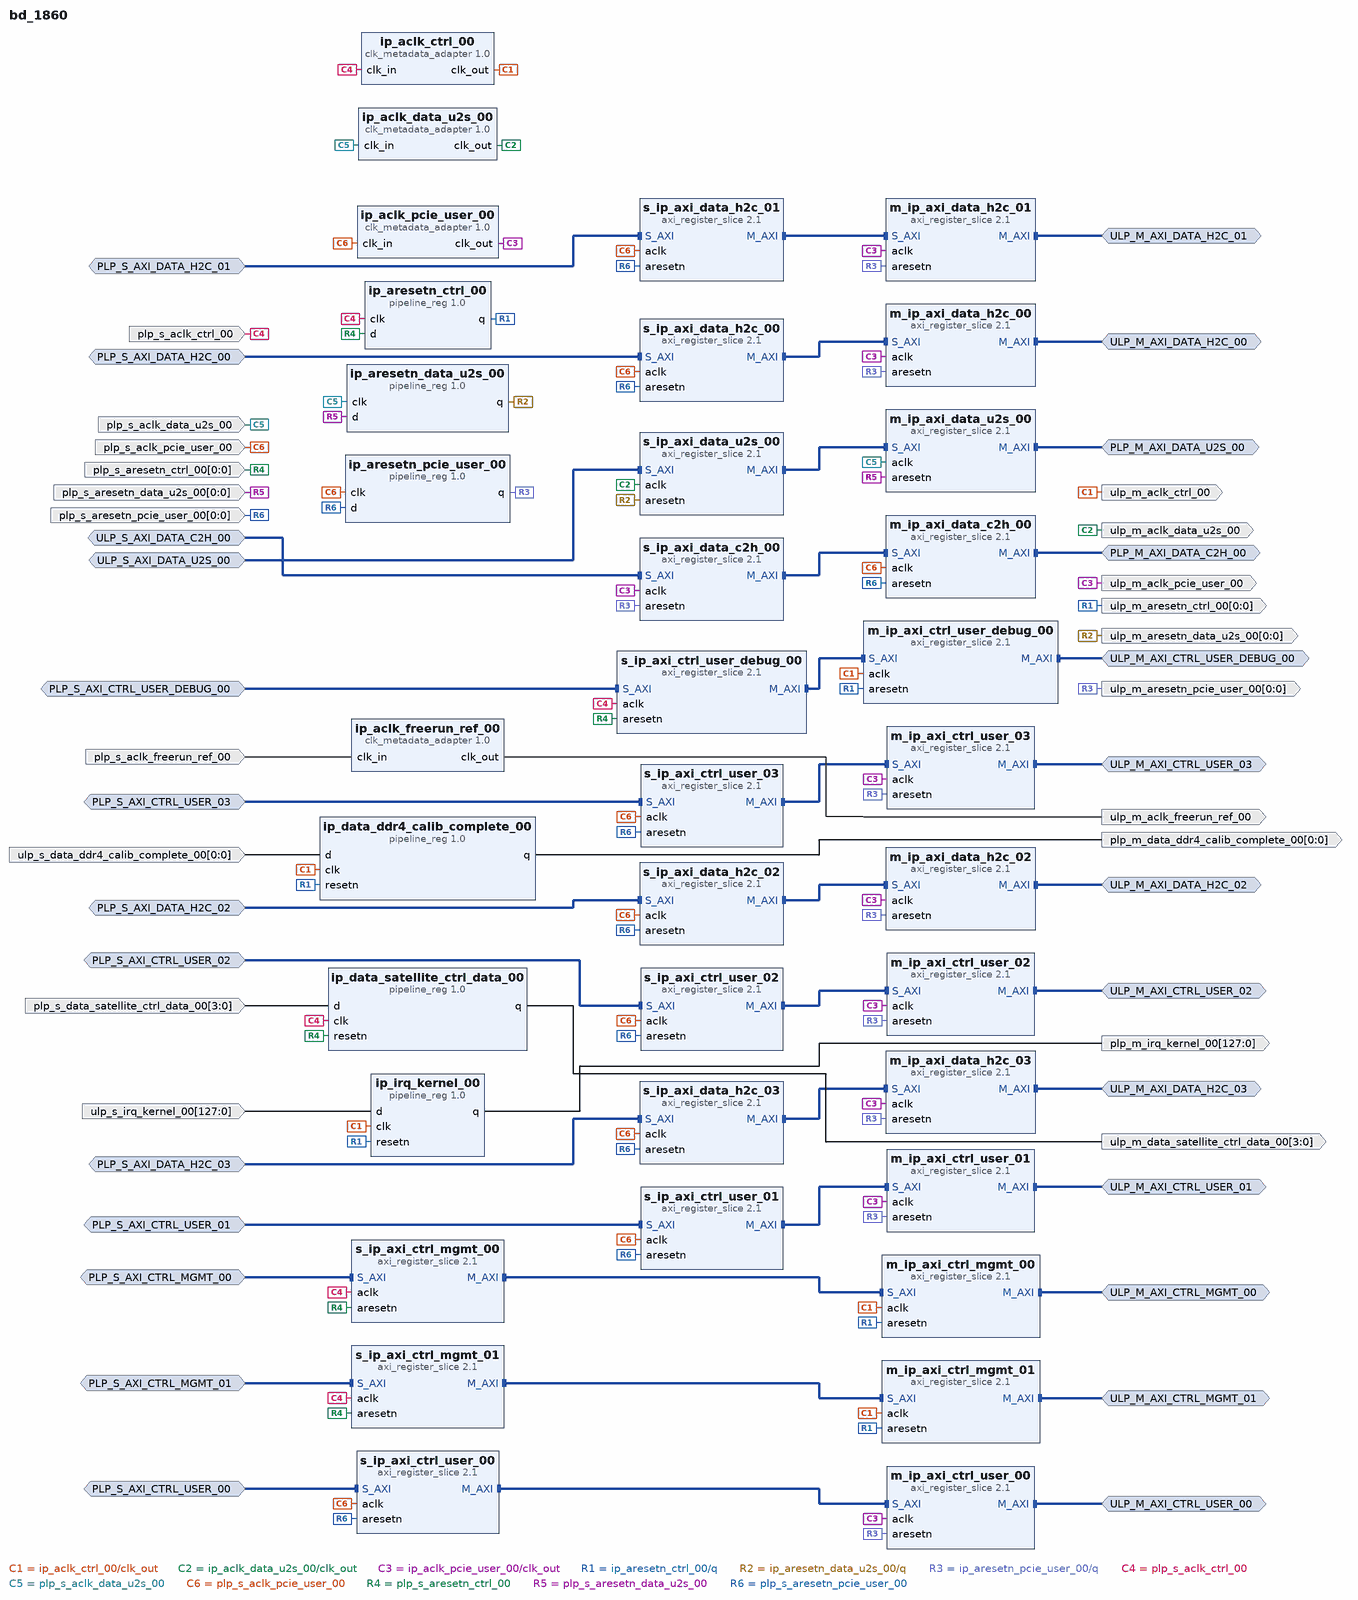
[diagram p0: block diagram of the top level]
# Vivado block design bd_1860, xcu250-figd2104-2L-e, Vivado 2022.2
create_bd_design bd_1860

create_bd_intf_port -mode Slave -vlnv xilinx.com:interface:aximm_rtl:1.0 PLP_S_AXI_CTRL_MGMT_00
set_property -dict [list \
  CONFIG.ADDR_WIDTH 24 \
  CONFIG.ARUSER_WIDTH 0 \
  CONFIG.AWUSER_WIDTH 0 \
  CONFIG.BUSER_WIDTH 0 \
  CONFIG.CLK_DOMAIN cd_ctrl_00 \
  CONFIG.DATA_WIDTH 32 \
  CONFIG.FREQ_HZ 50000000 \
  CONFIG.NUM_READ_OUTSTANDING 2 \
  CONFIG.NUM_WRITE_OUTSTANDING 2 \
  CONFIG.PHASE 0 \
  CONFIG.PROTOCOL AXI4LITE \
  CONFIG.READ_WRITE_MODE READ_WRITE \
  CONFIG.RUSER_WIDTH 0 \
  CONFIG.SLR_ASSIGNMENT slr0 \
  CONFIG.WUSER_WIDTH 0 \
] [get_bd_intf_ports PLP_S_AXI_CTRL_MGMT_00]
create_bd_intf_port -mode Master -vlnv xilinx.com:interface:aximm_rtl:1.0 ULP_M_AXI_CTRL_MGMT_00
set_property -dict [list \
  CONFIG.ADDR_WIDTH 24 \
  CONFIG.ARUSER_WIDTH 0 \
  CONFIG.AWUSER_WIDTH 0 \
  CONFIG.BUSER_WIDTH 0 \
  CONFIG.CLK_DOMAIN cd_ctrl_00 \
  CONFIG.DATA_WIDTH 32 \
  CONFIG.FREQ_HZ 50000000 \
  CONFIG.NUM_READ_OUTSTANDING 2 \
  CONFIG.NUM_WRITE_OUTSTANDING 2 \
  CONFIG.PHASE 0 \
  CONFIG.PROTOCOL AXI4LITE \
  CONFIG.READ_WRITE_MODE READ_WRITE \
  CONFIG.RUSER_WIDTH 0 \
  CONFIG.SLR_ASSIGNMENT slr0 \
  CONFIG.WUSER_WIDTH 0 \
] [get_bd_intf_ports ULP_M_AXI_CTRL_MGMT_00]
create_bd_intf_port -mode Slave -vlnv xilinx.com:interface:aximm_rtl:1.0 PLP_S_AXI_CTRL_MGMT_01
set_property -dict [list \
  CONFIG.ADDR_WIDTH 24 \
  CONFIG.ARUSER_WIDTH 0 \
  CONFIG.AWUSER_WIDTH 0 \
  CONFIG.BUSER_WIDTH 0 \
  CONFIG.CLK_DOMAIN cd_ctrl_00 \
  CONFIG.DATA_WIDTH 32 \
  CONFIG.FREQ_HZ 50000000 \
  CONFIG.NUM_READ_OUTSTANDING 2 \
  CONFIG.NUM_WRITE_OUTSTANDING 2 \
  CONFIG.PHASE 0 \
  CONFIG.PROTOCOL AXI4LITE \
  CONFIG.READ_WRITE_MODE READ_WRITE \
  CONFIG.RUSER_WIDTH 0 \
  CONFIG.SLR_ASSIGNMENT slr2 \
  CONFIG.WUSER_WIDTH 0 \
] [get_bd_intf_ports PLP_S_AXI_CTRL_MGMT_01]
create_bd_intf_port -mode Master -vlnv xilinx.com:interface:aximm_rtl:1.0 ULP_M_AXI_CTRL_MGMT_01
set_property -dict [list \
  CONFIG.ADDR_WIDTH 24 \
  CONFIG.ARUSER_WIDTH 0 \
  CONFIG.AWUSER_WIDTH 0 \
  CONFIG.BUSER_WIDTH 0 \
  CONFIG.CLK_DOMAIN cd_ctrl_00 \
  CONFIG.DATA_WIDTH 32 \
  CONFIG.FREQ_HZ 50000000 \
  CONFIG.NUM_READ_OUTSTANDING 2 \
  CONFIG.NUM_WRITE_OUTSTANDING 2 \
  CONFIG.PHASE 0 \
  CONFIG.PROTOCOL AXI4LITE \
  CONFIG.READ_WRITE_MODE READ_WRITE \
  CONFIG.RUSER_WIDTH 0 \
  CONFIG.SLR_ASSIGNMENT slr2 \
  CONFIG.WUSER_WIDTH 0 \
] [get_bd_intf_ports ULP_M_AXI_CTRL_MGMT_01]
create_bd_intf_port -mode Slave -vlnv xilinx.com:interface:aximm_rtl:1.0 PLP_S_AXI_CTRL_USER_00
set_property -dict [list \
  CONFIG.ADDR_WIDTH 25 \
  CONFIG.ARUSER_WIDTH 0 \
  CONFIG.AWUSER_WIDTH 0 \
  CONFIG.BUSER_WIDTH 0 \
  CONFIG.CLK_DOMAIN cd_pcie_user_00 \
  CONFIG.DATA_WIDTH 32 \
  CONFIG.FREQ_HZ 250000000 \
  CONFIG.NUM_READ_OUTSTANDING 2 \
  CONFIG.NUM_WRITE_OUTSTANDING 2 \
  CONFIG.PHASE 0 \
  CONFIG.PROTOCOL AXI4LITE \
  CONFIG.READ_WRITE_MODE READ_WRITE \
  CONFIG.RUSER_WIDTH 0 \
  CONFIG.SLR_ASSIGNMENT slr0 \
  CONFIG.WUSER_WIDTH 0 \
] [get_bd_intf_ports PLP_S_AXI_CTRL_USER_00]
create_bd_intf_port -mode Master -vlnv xilinx.com:interface:aximm_rtl:1.0 ULP_M_AXI_CTRL_USER_00
set_property -dict [list \
  CONFIG.ADDR_WIDTH 25 \
  CONFIG.ARUSER_WIDTH 0 \
  CONFIG.AWUSER_WIDTH 0 \
  CONFIG.BUSER_WIDTH 0 \
  CONFIG.CLK_DOMAIN cd_pcie_user_00 \
  CONFIG.DATA_WIDTH 32 \
  CONFIG.FREQ_HZ 250000000 \
  CONFIG.NUM_READ_OUTSTANDING 2 \
  CONFIG.NUM_WRITE_OUTSTANDING 2 \
  CONFIG.PHASE 0 \
  CONFIG.PROTOCOL AXI4LITE \
  CONFIG.READ_WRITE_MODE READ_WRITE \
  CONFIG.RUSER_WIDTH 0 \
  CONFIG.SLR_ASSIGNMENT slr0 \
  CONFIG.WUSER_WIDTH 0 \
] [get_bd_intf_ports ULP_M_AXI_CTRL_USER_00]
create_bd_intf_port -mode Slave -vlnv xilinx.com:interface:aximm_rtl:1.0 PLP_S_AXI_CTRL_USER_01
set_property -dict [list \
  CONFIG.ADDR_WIDTH 25 \
  CONFIG.ARUSER_WIDTH 0 \
  CONFIG.AWUSER_WIDTH 0 \
  CONFIG.BUSER_WIDTH 0 \
  CONFIG.CLK_DOMAIN cd_pcie_user_00 \
  CONFIG.DATA_WIDTH 32 \
  CONFIG.FREQ_HZ 250000000 \
  CONFIG.NUM_READ_OUTSTANDING 2 \
  CONFIG.NUM_WRITE_OUTSTANDING 2 \
  CONFIG.PHASE 0 \
  CONFIG.PROTOCOL AXI4LITE \
  CONFIG.READ_WRITE_MODE READ_WRITE \
  CONFIG.RUSER_WIDTH 0 \
  CONFIG.SLR_ASSIGNMENT slr1 \
  CONFIG.WUSER_WIDTH 0 \
] [get_bd_intf_ports PLP_S_AXI_CTRL_USER_01]
create_bd_intf_port -mode Master -vlnv xilinx.com:interface:aximm_rtl:1.0 ULP_M_AXI_CTRL_USER_01
set_property -dict [list \
  CONFIG.ADDR_WIDTH 25 \
  CONFIG.ARUSER_WIDTH 0 \
  CONFIG.AWUSER_WIDTH 0 \
  CONFIG.BUSER_WIDTH 0 \
  CONFIG.CLK_DOMAIN cd_pcie_user_00 \
  CONFIG.DATA_WIDTH 32 \
  CONFIG.FREQ_HZ 250000000 \
  CONFIG.NUM_READ_OUTSTANDING 2 \
  CONFIG.NUM_WRITE_OUTSTANDING 2 \
  CONFIG.PHASE 0 \
  CONFIG.PROTOCOL AXI4LITE \
  CONFIG.READ_WRITE_MODE READ_WRITE \
  CONFIG.RUSER_WIDTH 0 \
  CONFIG.SLR_ASSIGNMENT slr1 \
  CONFIG.WUSER_WIDTH 0 \
] [get_bd_intf_ports ULP_M_AXI_CTRL_USER_01]
create_bd_intf_port -mode Slave -vlnv xilinx.com:interface:aximm_rtl:1.0 PLP_S_AXI_CTRL_USER_02
set_property -dict [list \
  CONFIG.ADDR_WIDTH 25 \
  CONFIG.ARUSER_WIDTH 0 \
  CONFIG.AWUSER_WIDTH 0 \
  CONFIG.BUSER_WIDTH 0 \
  CONFIG.CLK_DOMAIN cd_pcie_user_00 \
  CONFIG.DATA_WIDTH 32 \
  CONFIG.FREQ_HZ 250000000 \
  CONFIG.NUM_READ_OUTSTANDING 2 \
  CONFIG.NUM_WRITE_OUTSTANDING 2 \
  CONFIG.PHASE 0 \
  CONFIG.PROTOCOL AXI4LITE \
  CONFIG.READ_WRITE_MODE READ_WRITE \
  CONFIG.RUSER_WIDTH 0 \
  CONFIG.SLR_ASSIGNMENT slr2 \
  CONFIG.WUSER_WIDTH 0 \
] [get_bd_intf_ports PLP_S_AXI_CTRL_USER_02]
create_bd_intf_port -mode Master -vlnv xilinx.com:interface:aximm_rtl:1.0 ULP_M_AXI_CTRL_USER_02
set_property -dict [list \
  CONFIG.ADDR_WIDTH 25 \
  CONFIG.ARUSER_WIDTH 0 \
  CONFIG.AWUSER_WIDTH 0 \
  CONFIG.BUSER_WIDTH 0 \
  CONFIG.CLK_DOMAIN cd_pcie_user_00 \
  CONFIG.DATA_WIDTH 32 \
  CONFIG.FREQ_HZ 250000000 \
  CONFIG.NUM_READ_OUTSTANDING 2 \
  CONFIG.NUM_WRITE_OUTSTANDING 2 \
  CONFIG.PHASE 0 \
  CONFIG.PROTOCOL AXI4LITE \
  CONFIG.READ_WRITE_MODE READ_WRITE \
  CONFIG.RUSER_WIDTH 0 \
  CONFIG.SLR_ASSIGNMENT slr2 \
  CONFIG.WUSER_WIDTH 0 \
] [get_bd_intf_ports ULP_M_AXI_CTRL_USER_02]
create_bd_intf_port -mode Slave -vlnv xilinx.com:interface:aximm_rtl:1.0 PLP_S_AXI_CTRL_USER_03
set_property -dict [list \
  CONFIG.ADDR_WIDTH 25 \
  CONFIG.ARUSER_WIDTH 0 \
  CONFIG.AWUSER_WIDTH 0 \
  CONFIG.BUSER_WIDTH 0 \
  CONFIG.CLK_DOMAIN cd_pcie_user_00 \
  CONFIG.DATA_WIDTH 32 \
  CONFIG.FREQ_HZ 250000000 \
  CONFIG.NUM_READ_OUTSTANDING 2 \
  CONFIG.NUM_WRITE_OUTSTANDING 2 \
  CONFIG.PHASE 0 \
  CONFIG.PROTOCOL AXI4LITE \
  CONFIG.READ_WRITE_MODE READ_WRITE \
  CONFIG.RUSER_WIDTH 0 \
  CONFIG.SLR_ASSIGNMENT slr2 \
  CONFIG.WUSER_WIDTH 0 \
] [get_bd_intf_ports PLP_S_AXI_CTRL_USER_03]
create_bd_intf_port -mode Master -vlnv xilinx.com:interface:aximm_rtl:1.0 ULP_M_AXI_CTRL_USER_03
set_property -dict [list \
  CONFIG.ADDR_WIDTH 25 \
  CONFIG.ARUSER_WIDTH 0 \
  CONFIG.AWUSER_WIDTH 0 \
  CONFIG.BUSER_WIDTH 0 \
  CONFIG.CLK_DOMAIN cd_pcie_user_00 \
  CONFIG.DATA_WIDTH 32 \
  CONFIG.FREQ_HZ 250000000 \
  CONFIG.NUM_READ_OUTSTANDING 2 \
  CONFIG.NUM_WRITE_OUTSTANDING 2 \
  CONFIG.PHASE 0 \
  CONFIG.PROTOCOL AXI4LITE \
  CONFIG.READ_WRITE_MODE READ_WRITE \
  CONFIG.RUSER_WIDTH 0 \
  CONFIG.SLR_ASSIGNMENT slr2 \
  CONFIG.WUSER_WIDTH 0 \
] [get_bd_intf_ports ULP_M_AXI_CTRL_USER_03]
create_bd_intf_port -mode Slave -vlnv xilinx.com:interface:aximm_rtl:1.0 PLP_S_AXI_CTRL_USER_DEBUG_00
set_property -dict [list \
  CONFIG.ADDR_WIDTH 25 \
  CONFIG.ARUSER_WIDTH 0 \
  CONFIG.AWUSER_WIDTH 0 \
  CONFIG.BUSER_WIDTH 0 \
  CONFIG.CLK_DOMAIN cd_ctrl_00 \
  CONFIG.DATA_WIDTH 32 \
  CONFIG.FREQ_HZ 50000000 \
  CONFIG.HAS_BRESP 1 \
  CONFIG.HAS_BURST 0 \
  CONFIG.HAS_CACHE 0 \
  CONFIG.HAS_LOCK 0 \
  CONFIG.HAS_PROT 1 \
  CONFIG.HAS_QOS 0 \
  CONFIG.HAS_REGION 1 \
  CONFIG.HAS_RRESP 1 \
  CONFIG.HAS_WSTRB 1 \
  CONFIG.ID_WIDTH 0 \
  CONFIG.MAX_BURST_LENGTH 1 \
  CONFIG.NUM_READ_OUTSTANDING 2 \
  CONFIG.NUM_READ_THREADS 1 \
  CONFIG.NUM_WRITE_OUTSTANDING 2 \
  CONFIG.NUM_WRITE_THREADS 1 \
  CONFIG.PHASE 0 \
  CONFIG.PROTOCOL AXI4LITE \
  CONFIG.READ_WRITE_MODE READ_WRITE \
  CONFIG.RUSER_BITS_PER_BYTE 0 \
  CONFIG.RUSER_WIDTH 0 \
  CONFIG.SUPPORTS_NARROW_BURST 0 \
  CONFIG.WUSER_BITS_PER_BYTE 0 \
  CONFIG.WUSER_WIDTH 0 \
] [get_bd_intf_ports PLP_S_AXI_CTRL_USER_DEBUG_00]
create_bd_intf_port -mode Master -vlnv xilinx.com:interface:aximm_rtl:1.0 ULP_M_AXI_CTRL_USER_DEBUG_00
set_property -dict [list \
  CONFIG.ADDR_WIDTH 25 \
  CONFIG.ARUSER_WIDTH 0 \
  CONFIG.AWUSER_WIDTH 0 \
  CONFIG.BUSER_WIDTH 0 \
  CONFIG.CLK_DOMAIN cd_ctrl_00 \
  CONFIG.DATA_WIDTH 32 \
  CONFIG.FREQ_HZ 50000000 \
  CONFIG.HAS_BRESP 1 \
  CONFIG.HAS_BURST 0 \
  CONFIG.HAS_CACHE 0 \
  CONFIG.HAS_LOCK 0 \
  CONFIG.HAS_PROT 1 \
  CONFIG.HAS_QOS 0 \
  CONFIG.HAS_REGION 1 \
  CONFIG.HAS_RRESP 1 \
  CONFIG.HAS_WSTRB 1 \
  CONFIG.ID_WIDTH 0 \
  CONFIG.MAX_BURST_LENGTH 1 \
  CONFIG.NUM_READ_OUTSTANDING 2 \
  CONFIG.NUM_READ_THREADS 1 \
  CONFIG.NUM_WRITE_OUTSTANDING 2 \
  CONFIG.NUM_WRITE_THREADS 1 \
  CONFIG.PHASE 0 \
  CONFIG.PROTOCOL AXI4LITE \
  CONFIG.READ_WRITE_MODE READ_WRITE \
  CONFIG.RUSER_BITS_PER_BYTE 0 \
  CONFIG.RUSER_WIDTH 0 \
  CONFIG.SUPPORTS_NARROW_BURST 0 \
  CONFIG.WUSER_BITS_PER_BYTE 0 \
  CONFIG.WUSER_WIDTH 0 \
] [get_bd_intf_ports ULP_M_AXI_CTRL_USER_DEBUG_00]
create_bd_intf_port -mode Slave -vlnv xilinx.com:interface:aximm_rtl:1.0 ULP_S_AXI_DATA_C2H_00
set_property -dict [list \
  CONFIG.ADDR_WIDTH 39 \
  CONFIG.ARUSER_WIDTH 0 \
  CONFIG.AWUSER_WIDTH 0 \
  CONFIG.BUSER_WIDTH 0 \
  CONFIG.CLK_DOMAIN cd_pcie_user_00 \
  CONFIG.DATA_WIDTH 512 \
  CONFIG.FREQ_HZ 250000000 \
  CONFIG.HAS_BRESP 1 \
  CONFIG.HAS_BURST 1 \
  CONFIG.HAS_CACHE 1 \
  CONFIG.HAS_LOCK 1 \
  CONFIG.HAS_PROT 1 \
  CONFIG.HAS_QOS 0 \
  CONFIG.HAS_REGION 0 \
  CONFIG.HAS_RRESP 1 \
  CONFIG.HAS_WSTRB 1 \
  CONFIG.ID_WIDTH 4 \
  CONFIG.MAX_BURST_LENGTH 256 \
  CONFIG.NUM_READ_OUTSTANDING 64 \
  CONFIG.NUM_READ_THREADS 2 \
  CONFIG.NUM_WRITE_OUTSTANDING 32 \
  CONFIG.NUM_WRITE_THREADS 2 \
  CONFIG.PHASE 0 \
  CONFIG.PROTOCOL AXI4 \
  CONFIG.READ_WRITE_MODE READ_WRITE \
  CONFIG.RUSER_BITS_PER_BYTE 0 \
  CONFIG.RUSER_WIDTH 0 \
  CONFIG.SLR_ASSIGNMENT slr2 \
  CONFIG.SUPPORTS_NARROW_BURST 0 \
  CONFIG.WUSER_BITS_PER_BYTE 0 \
  CONFIG.WUSER_WIDTH 0 \
] [get_bd_intf_ports ULP_S_AXI_DATA_C2H_00]
create_bd_intf_port -mode Master -vlnv xilinx.com:interface:aximm_rtl:1.0 PLP_M_AXI_DATA_C2H_00
set_property -dict [list \
  CONFIG.ADDR_WIDTH 39 \
  CONFIG.ARUSER_WIDTH 0 \
  CONFIG.AWUSER_WIDTH 0 \
  CONFIG.BUSER_WIDTH 0 \
  CONFIG.CLK_DOMAIN cd_pcie_user_00 \
  CONFIG.DATA_WIDTH 512 \
  CONFIG.FREQ_HZ 250000000 \
  CONFIG.HAS_BRESP 1 \
  CONFIG.HAS_BURST 1 \
  CONFIG.HAS_CACHE 1 \
  CONFIG.HAS_LOCK 1 \
  CONFIG.HAS_PROT 1 \
  CONFIG.HAS_QOS 0 \
  CONFIG.HAS_REGION 0 \
  CONFIG.HAS_RRESP 1 \
  CONFIG.HAS_WSTRB 1 \
  CONFIG.ID_WIDTH 4 \
  CONFIG.MAX_BURST_LENGTH 256 \
  CONFIG.NUM_READ_OUTSTANDING 64 \
  CONFIG.NUM_READ_THREADS 2 \
  CONFIG.NUM_WRITE_OUTSTANDING 32 \
  CONFIG.NUM_WRITE_THREADS 2 \
  CONFIG.PHASE 0 \
  CONFIG.PROTOCOL AXI4 \
  CONFIG.READ_WRITE_MODE READ_WRITE \
  CONFIG.RUSER_BITS_PER_BYTE 0 \
  CONFIG.RUSER_WIDTH 0 \
  CONFIG.SLR_ASSIGNMENT slr2 \
  CONFIG.SUPPORTS_NARROW_BURST 0 \
  CONFIG.WUSER_BITS_PER_BYTE 0 \
  CONFIG.WUSER_WIDTH 0 \
] [get_bd_intf_ports PLP_M_AXI_DATA_C2H_00]
create_bd_intf_port -mode Slave -vlnv xilinx.com:interface:aximm_rtl:1.0 PLP_S_AXI_DATA_H2C_00
set_property -dict [list \
  CONFIG.ADDR_WIDTH 39 \
  CONFIG.ARUSER_WIDTH 0 \
  CONFIG.AWUSER_WIDTH 0 \
  CONFIG.BUSER_WIDTH 0 \
  CONFIG.CLK_DOMAIN cd_pcie_user_00 \
  CONFIG.DATA_WIDTH 512 \
  CONFIG.FREQ_HZ 250000000 \
  CONFIG.HAS_BRESP 1 \
  CONFIG.HAS_BURST 1 \
  CONFIG.HAS_CACHE 1 \
  CONFIG.HAS_LOCK 1 \
  CONFIG.HAS_PROT 1 \
  CONFIG.HAS_QOS 0 \
  CONFIG.HAS_REGION 0 \
  CONFIG.HAS_RRESP 1 \
  CONFIG.HAS_WSTRB 1 \
  CONFIG.ID_WIDTH 4 \
  CONFIG.MAX_BURST_LENGTH 256 \
  CONFIG.NUM_READ_OUTSTANDING 16 \
  CONFIG.NUM_READ_THREADS 2 \
  CONFIG.NUM_WRITE_OUTSTANDING 32 \
  CONFIG.NUM_WRITE_THREADS 2 \
  CONFIG.PHASE 0 \
  CONFIG.PROTOCOL AXI4 \
  CONFIG.READ_WRITE_MODE READ_WRITE \
  CONFIG.RUSER_BITS_PER_BYTE 0 \
  CONFIG.RUSER_WIDTH 0 \
  CONFIG.SLR_ASSIGNMENT slr0 \
  CONFIG.SUPPORTS_NARROW_BURST 0 \
  CONFIG.WUSER_BITS_PER_BYTE 0 \
  CONFIG.WUSER_WIDTH 0 \
] [get_bd_intf_ports PLP_S_AXI_DATA_H2C_00]
create_bd_intf_port -mode Master -vlnv xilinx.com:interface:aximm_rtl:1.0 ULP_M_AXI_DATA_H2C_00
set_property -dict [list \
  CONFIG.ADDR_WIDTH 39 \
  CONFIG.ARUSER_WIDTH 0 \
  CONFIG.AWUSER_WIDTH 0 \
  CONFIG.BUSER_WIDTH 0 \
  CONFIG.CLK_DOMAIN cd_pcie_user_00 \
  CONFIG.DATA_WIDTH 512 \
  CONFIG.FREQ_HZ 250000000 \
  CONFIG.HAS_BRESP 1 \
  CONFIG.HAS_BURST 1 \
  CONFIG.HAS_CACHE 1 \
  CONFIG.HAS_LOCK 1 \
  CONFIG.HAS_PROT 1 \
  CONFIG.HAS_QOS 0 \
  CONFIG.HAS_REGION 0 \
  CONFIG.HAS_RRESP 1 \
  CONFIG.HAS_WSTRB 1 \
  CONFIG.ID_WIDTH 4 \
  CONFIG.MAX_BURST_LENGTH 256 \
  CONFIG.NUM_READ_OUTSTANDING 16 \
  CONFIG.NUM_READ_THREADS 2 \
  CONFIG.NUM_WRITE_OUTSTANDING 32 \
  CONFIG.NUM_WRITE_THREADS 2 \
  CONFIG.PHASE 0 \
  CONFIG.PROTOCOL AXI4 \
  CONFIG.READ_WRITE_MODE READ_WRITE \
  CONFIG.RUSER_BITS_PER_BYTE 0 \
  CONFIG.RUSER_WIDTH 0 \
  CONFIG.SLR_ASSIGNMENT slr0 \
  CONFIG.SUPPORTS_NARROW_BURST 0 \
  CONFIG.WUSER_BITS_PER_BYTE 0 \
  CONFIG.WUSER_WIDTH 0 \
] [get_bd_intf_ports ULP_M_AXI_DATA_H2C_00]
create_bd_intf_port -mode Slave -vlnv xilinx.com:interface:aximm_rtl:1.0 PLP_S_AXI_DATA_H2C_01
set_property -dict [list \
  CONFIG.ADDR_WIDTH 39 \
  CONFIG.ARUSER_WIDTH 0 \
  CONFIG.AWUSER_WIDTH 0 \
  CONFIG.BUSER_WIDTH 0 \
  CONFIG.CLK_DOMAIN cd_pcie_user_00 \
  CONFIG.DATA_WIDTH 512 \
  CONFIG.FREQ_HZ 250000000 \
  CONFIG.HAS_BRESP 1 \
  CONFIG.HAS_BURST 1 \
  CONFIG.HAS_CACHE 1 \
  CONFIG.HAS_LOCK 1 \
  CONFIG.HAS_PROT 1 \
  CONFIG.HAS_QOS 0 \
  CONFIG.HAS_REGION 0 \
  CONFIG.HAS_RRESP 1 \
  CONFIG.HAS_WSTRB 1 \
  CONFIG.ID_WIDTH 4 \
  CONFIG.MAX_BURST_LENGTH 256 \
  CONFIG.NUM_READ_OUTSTANDING 16 \
  CONFIG.NUM_READ_THREADS 2 \
  CONFIG.NUM_WRITE_OUTSTANDING 32 \
  CONFIG.NUM_WRITE_THREADS 2 \
  CONFIG.PHASE 0 \
  CONFIG.PROTOCOL AXI4 \
  CONFIG.READ_WRITE_MODE READ_WRITE \
  CONFIG.RUSER_BITS_PER_BYTE 0 \
  CONFIG.RUSER_WIDTH 0 \
  CONFIG.SLR_ASSIGNMENT slr1 \
  CONFIG.SUPPORTS_NARROW_BURST 0 \
  CONFIG.WUSER_BITS_PER_BYTE 0 \
  CONFIG.WUSER_WIDTH 0 \
] [get_bd_intf_ports PLP_S_AXI_DATA_H2C_01]
create_bd_intf_port -mode Master -vlnv xilinx.com:interface:aximm_rtl:1.0 ULP_M_AXI_DATA_H2C_01
set_property -dict [list \
  CONFIG.ADDR_WIDTH 39 \
  CONFIG.ARUSER_WIDTH 0 \
  CONFIG.AWUSER_WIDTH 0 \
  CONFIG.BUSER_WIDTH 0 \
  CONFIG.CLK_DOMAIN cd_pcie_user_00 \
  CONFIG.DATA_WIDTH 512 \
  CONFIG.FREQ_HZ 250000000 \
  CONFIG.HAS_BRESP 1 \
  CONFIG.HAS_BURST 1 \
  CONFIG.HAS_CACHE 1 \
  CONFIG.HAS_LOCK 1 \
  CONFIG.HAS_PROT 1 \
  CONFIG.HAS_QOS 0 \
  CONFIG.HAS_REGION 0 \
  CONFIG.HAS_RRESP 1 \
  CONFIG.HAS_WSTRB 1 \
  CONFIG.ID_WIDTH 4 \
  CONFIG.MAX_BURST_LENGTH 256 \
  CONFIG.NUM_READ_OUTSTANDING 16 \
  CONFIG.NUM_READ_THREADS 2 \
  CONFIG.NUM_WRITE_OUTSTANDING 32 \
  CONFIG.NUM_WRITE_THREADS 2 \
  CONFIG.PHASE 0 \
  CONFIG.PROTOCOL AXI4 \
  CONFIG.READ_WRITE_MODE READ_WRITE \
  CONFIG.RUSER_BITS_PER_BYTE 0 \
  CONFIG.RUSER_WIDTH 0 \
  CONFIG.SLR_ASSIGNMENT slr1 \
  CONFIG.SUPPORTS_NARROW_BURST 0 \
  CONFIG.WUSER_BITS_PER_BYTE 0 \
  CONFIG.WUSER_WIDTH 0 \
] [get_bd_intf_ports ULP_M_AXI_DATA_H2C_01]
create_bd_intf_port -mode Slave -vlnv xilinx.com:interface:aximm_rtl:1.0 PLP_S_AXI_DATA_H2C_02
set_property -dict [list \
  CONFIG.ADDR_WIDTH 39 \
  CONFIG.ARUSER_WIDTH 0 \
  CONFIG.AWUSER_WIDTH 0 \
  CONFIG.BUSER_WIDTH 0 \
  CONFIG.CLK_DOMAIN cd_pcie_user_00 \
  CONFIG.DATA_WIDTH 512 \
  CONFIG.FREQ_HZ 250000000 \
  CONFIG.HAS_BRESP 1 \
  CONFIG.HAS_BURST 1 \
  CONFIG.HAS_CACHE 1 \
  CONFIG.HAS_LOCK 1 \
  CONFIG.HAS_PROT 1 \
  CONFIG.HAS_QOS 0 \
  CONFIG.HAS_REGION 0 \
  CONFIG.HAS_RRESP 1 \
  CONFIG.HAS_WSTRB 1 \
  CONFIG.ID_WIDTH 4 \
  CONFIG.MAX_BURST_LENGTH 256 \
  CONFIG.NUM_READ_OUTSTANDING 16 \
  CONFIG.NUM_READ_THREADS 2 \
  CONFIG.NUM_WRITE_OUTSTANDING 32 \
  CONFIG.NUM_WRITE_THREADS 2 \
  CONFIG.PHASE 0 \
  CONFIG.PROTOCOL AXI4 \
  CONFIG.READ_WRITE_MODE READ_WRITE \
  CONFIG.RUSER_BITS_PER_BYTE 0 \
  CONFIG.RUSER_WIDTH 0 \
  CONFIG.SLR_ASSIGNMENT slr2 \
  CONFIG.SUPPORTS_NARROW_BURST 0 \
  CONFIG.WUSER_BITS_PER_BYTE 0 \
  CONFIG.WUSER_WIDTH 0 \
] [get_bd_intf_ports PLP_S_AXI_DATA_H2C_02]
create_bd_intf_port -mode Master -vlnv xilinx.com:interface:aximm_rtl:1.0 ULP_M_AXI_DATA_H2C_02
set_property -dict [list \
  CONFIG.ADDR_WIDTH 39 \
  CONFIG.ARUSER_WIDTH 0 \
  CONFIG.AWUSER_WIDTH 0 \
  CONFIG.BUSER_WIDTH 0 \
  CONFIG.CLK_DOMAIN cd_pcie_user_00 \
  CONFIG.DATA_WIDTH 512 \
  CONFIG.FREQ_HZ 250000000 \
  CONFIG.HAS_BRESP 1 \
  CONFIG.HAS_BURST 1 \
  CONFIG.HAS_CACHE 1 \
  CONFIG.HAS_LOCK 1 \
  CONFIG.HAS_PROT 1 \
  CONFIG.HAS_QOS 0 \
  CONFIG.HAS_REGION 0 \
  CONFIG.HAS_RRESP 1 \
  CONFIG.HAS_WSTRB 1 \
  CONFIG.ID_WIDTH 4 \
  CONFIG.MAX_BURST_LENGTH 256 \
  CONFIG.NUM_READ_OUTSTANDING 16 \
  CONFIG.NUM_READ_THREADS 2 \
  CONFIG.NUM_WRITE_OUTSTANDING 32 \
  CONFIG.NUM_WRITE_THREADS 2 \
  CONFIG.PHASE 0 \
  CONFIG.PROTOCOL AXI4 \
  CONFIG.READ_WRITE_MODE READ_WRITE \
  CONFIG.RUSER_BITS_PER_BYTE 0 \
  CONFIG.RUSER_WIDTH 0 \
  CONFIG.SLR_ASSIGNMENT slr2 \
  CONFIG.SUPPORTS_NARROW_BURST 0 \
  CONFIG.WUSER_BITS_PER_BYTE 0 \
  CONFIG.WUSER_WIDTH 0 \
] [get_bd_intf_ports ULP_M_AXI_DATA_H2C_02]
create_bd_intf_port -mode Slave -vlnv xilinx.com:interface:aximm_rtl:1.0 PLP_S_AXI_DATA_H2C_03
set_property -dict [list \
  CONFIG.ADDR_WIDTH 39 \
  CONFIG.ARUSER_WIDTH 0 \
  CONFIG.AWUSER_WIDTH 0 \
  CONFIG.BUSER_WIDTH 0 \
  CONFIG.CLK_DOMAIN cd_pcie_user_00 \
  CONFIG.DATA_WIDTH 512 \
  CONFIG.FREQ_HZ 250000000 \
  CONFIG.HAS_BRESP 1 \
  CONFIG.HAS_BURST 1 \
  CONFIG.HAS_CACHE 1 \
  CONFIG.HAS_LOCK 1 \
  CONFIG.HAS_PROT 1 \
  CONFIG.HAS_QOS 0 \
  CONFIG.HAS_REGION 0 \
  CONFIG.HAS_RRESP 1 \
  CONFIG.HAS_WSTRB 1 \
  CONFIG.ID_WIDTH 4 \
  CONFIG.MAX_BURST_LENGTH 256 \
  CONFIG.NUM_READ_OUTSTANDING 16 \
  CONFIG.NUM_READ_THREADS 2 \
  CONFIG.NUM_WRITE_OUTSTANDING 32 \
  CONFIG.NUM_WRITE_THREADS 2 \
  CONFIG.PHASE 0 \
  CONFIG.PROTOCOL AXI4 \
  CONFIG.READ_WRITE_MODE READ_WRITE \
  CONFIG.RUSER_BITS_PER_BYTE 0 \
  CONFIG.RUSER_WIDTH 0 \
  CONFIG.SLR_ASSIGNMENT slr2 \
  CONFIG.SUPPORTS_NARROW_BURST 0 \
  CONFIG.WUSER_BITS_PER_BYTE 0 \
  CONFIG.WUSER_WIDTH 0 \
] [get_bd_intf_ports PLP_S_AXI_DATA_H2C_03]
create_bd_intf_port -mode Master -vlnv xilinx.com:interface:aximm_rtl:1.0 ULP_M_AXI_DATA_H2C_03
set_property -dict [list \
  CONFIG.ADDR_WIDTH 39 \
  CONFIG.ARUSER_WIDTH 0 \
  CONFIG.AWUSER_WIDTH 0 \
  CONFIG.BUSER_WIDTH 0 \
  CONFIG.CLK_DOMAIN cd_pcie_user_00 \
  CONFIG.DATA_WIDTH 512 \
  CONFIG.FREQ_HZ 250000000 \
  CONFIG.HAS_BRESP 1 \
  CONFIG.HAS_BURST 1 \
  CONFIG.HAS_CACHE 1 \
  CONFIG.HAS_LOCK 1 \
  CONFIG.HAS_PROT 1 \
  CONFIG.HAS_QOS 0 \
  CONFIG.HAS_REGION 0 \
  CONFIG.HAS_RRESP 1 \
  CONFIG.HAS_WSTRB 1 \
  CONFIG.ID_WIDTH 4 \
  CONFIG.MAX_BURST_LENGTH 256 \
  CONFIG.NUM_READ_OUTSTANDING 16 \
  CONFIG.NUM_READ_THREADS 2 \
  CONFIG.NUM_WRITE_OUTSTANDING 32 \
  CONFIG.NUM_WRITE_THREADS 2 \
  CONFIG.PHASE 0 \
  CONFIG.PROTOCOL AXI4 \
  CONFIG.READ_WRITE_MODE READ_WRITE \
  CONFIG.RUSER_BITS_PER_BYTE 0 \
  CONFIG.RUSER_WIDTH 0 \
  CONFIG.SLR_ASSIGNMENT slr2 \
  CONFIG.SUPPORTS_NARROW_BURST 0 \
  CONFIG.WUSER_BITS_PER_BYTE 0 \
  CONFIG.WUSER_WIDTH 0 \
] [get_bd_intf_ports ULP_M_AXI_DATA_H2C_03]
create_bd_intf_port -mode Slave -vlnv xilinx.com:interface:aximm_rtl:1.0 ULP_S_AXI_DATA_U2S_00
set_property -dict [list \
  CONFIG.ADDR_WIDTH 39 \
  CONFIG.ARUSER_WIDTH 0 \
  CONFIG.AWUSER_WIDTH 0 \
  CONFIG.BUSER_WIDTH 0 \
  CONFIG.CLK_DOMAIN cd_data_u2s_00 \
  CONFIG.DATA_WIDTH 512 \
  CONFIG.FREQ_HZ 300000000 \
  CONFIG.HAS_BRESP 1 \
  CONFIG.HAS_BURST 1 \
  CONFIG.HAS_CACHE 1 \
  CONFIG.HAS_LOCK 1 \
  CONFIG.HAS_PROT 1 \
  CONFIG.HAS_QOS 0 \
  CONFIG.HAS_REGION 0 \
  CONFIG.HAS_RRESP 1 \
  CONFIG.HAS_WSTRB 1 \
  CONFIG.ID_WIDTH 4 \
  CONFIG.MAX_BURST_LENGTH 256 \
  CONFIG.NUM_READ_OUTSTANDING 16 \
  CONFIG.NUM_READ_THREADS 2 \
  CONFIG.NUM_WRITE_OUTSTANDING 32 \
  CONFIG.NUM_WRITE_THREADS 2 \
  CONFIG.PHASE 0 \
  CONFIG.PROTOCOL AXI4 \
  CONFIG.READ_WRITE_MODE READ_WRITE \
  CONFIG.RUSER_BITS_PER_BYTE 0 \
  CONFIG.RUSER_WIDTH 0 \
  CONFIG.SLR_ASSIGNMENT slr1 \
  CONFIG.SUPPORTS_NARROW_BURST 0 \
  CONFIG.WUSER_BITS_PER_BYTE 0 \
  CONFIG.WUSER_WIDTH 0 \
] [get_bd_intf_ports ULP_S_AXI_DATA_U2S_00]
create_bd_intf_port -mode Master -vlnv xilinx.com:interface:aximm_rtl:1.0 PLP_M_AXI_DATA_U2S_00
set_property -dict [list \
  CONFIG.ADDR_WIDTH 39 \
  CONFIG.ARUSER_WIDTH 0 \
  CONFIG.AWUSER_WIDTH 0 \
  CONFIG.BUSER_WIDTH 0 \
  CONFIG.CLK_DOMAIN cd_data_u2s_00 \
  CONFIG.DATA_WIDTH 512 \
  CONFIG.FREQ_HZ 300000000 \
  CONFIG.HAS_BRESP 1 \
  CONFIG.HAS_BURST 1 \
  CONFIG.HAS_CACHE 1 \
  CONFIG.HAS_LOCK 1 \
  CONFIG.HAS_PROT 1 \
  CONFIG.HAS_QOS 0 \
  CONFIG.HAS_REGION 0 \
  CONFIG.HAS_RRESP 1 \
  CONFIG.HAS_WSTRB 1 \
  CONFIG.ID_WIDTH 4 \
  CONFIG.MAX_BURST_LENGTH 256 \
  CONFIG.NUM_READ_OUTSTANDING 16 \
  CONFIG.NUM_READ_THREADS 2 \
  CONFIG.NUM_WRITE_OUTSTANDING 32 \
  CONFIG.NUM_WRITE_THREADS 2 \
  CONFIG.PHASE 0 \
  CONFIG.PROTOCOL AXI4 \
  CONFIG.READ_WRITE_MODE READ_WRITE \
  CONFIG.RUSER_BITS_PER_BYTE 0 \
  CONFIG.RUSER_WIDTH 0 \
  CONFIG.SLR_ASSIGNMENT slr1 \
  CONFIG.SUPPORTS_NARROW_BURST 0 \
  CONFIG.WUSER_BITS_PER_BYTE 0 \
  CONFIG.WUSER_WIDTH 0 \
] [get_bd_intf_ports PLP_M_AXI_DATA_U2S_00]
create_bd_port -dir I -type clk plp_s_aclk_ctrl_00
set_property -dict [list \
  CONFIG.ASSOCIATED_RESET PLP_S_ARESETN_CTRL_00 \
  CONFIG.CLK_DOMAIN cd_ctrl_00 \
  CONFIG.FREQ_HZ 50000000 \
  CONFIG.PHASE 0 \
] [get_bd_ports plp_s_aclk_ctrl_00]
create_bd_port -dir O -type clk ulp_m_aclk_ctrl_00
set_property -dict [list \
  CONFIG.ASSOCIATED_RESET ULP_M_ARESETN_CTRL_00 \
  CONFIG.CLK_DOMAIN cd_ctrl_00 \
  CONFIG.FREQ_HZ 50000000 \
  CONFIG.PHASE 0 \
] [get_bd_ports ulp_m_aclk_ctrl_00]
create_bd_port -dir I -type clk plp_s_aclk_pcie_user_00
set_property -dict [list \
  CONFIG.ASSOCIATED_RESET PLP_S_ARESETN_PCIE_USER_00 \
  CONFIG.CLK_DOMAIN cd_pcie_user_00 \
  CONFIG.FREQ_HZ 250000000 \
  CONFIG.PHASE 0 \
] [get_bd_ports plp_s_aclk_pcie_user_00]
create_bd_port -dir O -type clk ulp_m_aclk_pcie_user_00
set_property -dict [list \
  CONFIG.ASSOCIATED_RESET ULP_M_ARESETN_PCIE_USER_00 \
  CONFIG.CLK_DOMAIN cd_pcie_user_00 \
  CONFIG.FREQ_HZ 250000000 \
  CONFIG.PHASE 0 \
] [get_bd_ports ulp_m_aclk_pcie_user_00]
create_bd_port -dir I -type clk plp_s_aclk_freerun_ref_00
set_property -dict [list \
  CONFIG.CLK_DOMAIN cd_freerun_ref_00 \
  CONFIG.FREQ_HZ 100000000 \
  CONFIG.PHASE 0 \
] [get_bd_ports plp_s_aclk_freerun_ref_00]
create_bd_port -dir O -type clk ulp_m_aclk_freerun_ref_00
set_property -dict [list \
  CONFIG.CLK_DOMAIN cd_freerun_ref_00 \
  CONFIG.FREQ_HZ 100000000 \
  CONFIG.PHASE 0 \
] [get_bd_ports ulp_m_aclk_freerun_ref_00]
create_bd_port -dir I -type clk plp_s_aclk_data_u2s_00
set_property -dict [list \
  CONFIG.ASSOCIATED_RESET PLP_S_ARESETN_DATA_U2S_00 \
  CONFIG.CLK_DOMAIN cd_data_u2s_00 \
  CONFIG.FREQ_HZ 300000000 \
  CONFIG.PHASE 0 \
] [get_bd_ports plp_s_aclk_data_u2s_00]
create_bd_port -dir O -type clk ulp_m_aclk_data_u2s_00
set_property -dict [list \
  CONFIG.ASSOCIATED_RESET ULP_M_ARESETN_DATA_U2S_00 \
  CONFIG.CLK_DOMAIN cd_data_u2s_00 \
  CONFIG.FREQ_HZ 300000000 \
  CONFIG.PHASE 0 \
] [get_bd_ports ulp_m_aclk_data_u2s_00]
create_bd_port -dir I -from 0 -to 0 -type rst plp_s_aresetn_ctrl_00
set_property -dict {CONFIG.POLARITY ACTIVE_LOW} [get_bd_ports plp_s_aresetn_ctrl_00]
create_bd_port -dir O -from 0 -to 0 -type rst ulp_m_aresetn_ctrl_00
set_property -dict {CONFIG.POLARITY ACTIVE_LOW} [get_bd_ports ulp_m_aresetn_ctrl_00]
create_bd_port -dir I -from 0 -to 0 -type rst plp_s_aresetn_pcie_user_00
set_property -dict {CONFIG.POLARITY ACTIVE_LOW} [get_bd_ports plp_s_aresetn_pcie_user_00]
create_bd_port -dir O -from 0 -to 0 -type rst ulp_m_aresetn_pcie_user_00
set_property -dict {CONFIG.POLARITY ACTIVE_LOW} [get_bd_ports ulp_m_aresetn_pcie_user_00]
create_bd_port -dir I -from 0 -to 0 -type rst plp_s_aresetn_data_u2s_00
set_property -dict {CONFIG.POLARITY ACTIVE_LOW} [get_bd_ports plp_s_aresetn_data_u2s_00]
create_bd_port -dir O -from 0 -to 0 -type rst ulp_m_aresetn_data_u2s_00
set_property -dict {CONFIG.POLARITY ACTIVE_LOW} [get_bd_ports ulp_m_aresetn_data_u2s_00]
create_bd_port -dir I -from 0 -to 0 -type data ulp_s_data_ddr4_calib_complete_00
create_bd_port -dir O -from 0 -to 0 -type data plp_m_data_ddr4_calib_complete_00
create_bd_port -dir I -from 3 -to 0 -type data plp_s_data_satellite_ctrl_data_00
create_bd_port -dir O -from 3 -to 0 -type data ulp_m_data_satellite_ctrl_data_00
create_bd_port -dir I -from 127 -to 0 -type intr ulp_s_irq_kernel_00
set_property -dict {CONFIG.PortWidth 128 CONFIG.SENSITIVITY level_high} [get_bd_ports ulp_s_irq_kernel_00]
create_bd_port -dir O -from 127 -to 0 -type intr plp_m_irq_kernel_00
set_property -dict {CONFIG.SENSITIVITY level_high} [get_bd_ports plp_m_irq_kernel_00]

create_bd_cell -type ip -vlnv xilinx.com:ip:clk_metadata_adapter:1.0 ip_aclk_ctrl_00
create_bd_cell -type ip -vlnv xilinx.com:ip:clk_metadata_adapter:1.0 ip_aclk_pcie_user_00
create_bd_cell -type ip -vlnv xilinx.com:ip:clk_metadata_adapter:1.0 ip_aclk_freerun_ref_00
create_bd_cell -type ip -vlnv xilinx.com:ip:clk_metadata_adapter:1.0 ip_aclk_data_u2s_00
create_bd_cell -type ip -vlnv xilinx.com:ip:pipeline_reg:1.0 ip_aresetn_ctrl_00
set_property -dict {CONFIG.DEPTH 0} [get_bd_cells ip_aresetn_ctrl_00]
create_bd_cell -type ip -vlnv xilinx.com:ip:pipeline_reg:1.0 ip_aresetn_pcie_user_00
set_property -dict {CONFIG.DEPTH 0} [get_bd_cells ip_aresetn_pcie_user_00]
create_bd_cell -type ip -vlnv xilinx.com:ip:pipeline_reg:1.0 ip_aresetn_data_u2s_00
set_property -dict {CONFIG.DEPTH 0} [get_bd_cells ip_aresetn_data_u2s_00]
create_bd_cell -type ip -vlnv xilinx.com:ip:axi_register_slice:2.1 s_ip_axi_ctrl_mgmt_00
set_property -dict [list \
  CONFIG.ADDR_WIDTH 24 \
  CONFIG.DATA_WIDTH 32 \
  CONFIG.NUM_READ_OUTSTANDING 2 \
  CONFIG.NUM_WRITE_OUTSTANDING 2 \
  CONFIG.PROTOCOL AXI4LITE \
  CONFIG.READ_WRITE_MODE READ_WRITE \
  CONFIG.REG_AR 0 \
  CONFIG.REG_AW 0 \
  CONFIG.REG_B 0 \
  CONFIG.REG_R 0 \
  CONFIG.REG_W 0 \
] [get_bd_cells s_ip_axi_ctrl_mgmt_00]
create_bd_cell -type ip -vlnv xilinx.com:ip:axi_register_slice:2.1 m_ip_axi_ctrl_mgmt_00
set_property -dict [list \
  CONFIG.ADDR_WIDTH 24 \
  CONFIG.DATA_WIDTH 32 \
  CONFIG.NUM_READ_OUTSTANDING 2 \
  CONFIG.NUM_WRITE_OUTSTANDING 2 \
  CONFIG.PROTOCOL AXI4LITE \
  CONFIG.READ_WRITE_MODE READ_WRITE \
  CONFIG.REG_AR 0 \
  CONFIG.REG_AW 0 \
  CONFIG.REG_B 0 \
  CONFIG.REG_R 0 \
  CONFIG.REG_W 0 \
] [get_bd_cells m_ip_axi_ctrl_mgmt_00]
create_bd_cell -type ip -vlnv xilinx.com:ip:axi_register_slice:2.1 s_ip_axi_ctrl_mgmt_01
set_property -dict [list \
  CONFIG.ADDR_WIDTH 24 \
  CONFIG.DATA_WIDTH 32 \
  CONFIG.NUM_READ_OUTSTANDING 2 \
  CONFIG.NUM_WRITE_OUTSTANDING 2 \
  CONFIG.PROTOCOL AXI4LITE \
  CONFIG.READ_WRITE_MODE READ_WRITE \
  CONFIG.REG_AR 0 \
  CONFIG.REG_AW 0 \
  CONFIG.REG_B 0 \
  CONFIG.REG_R 0 \
  CONFIG.REG_W 0 \
] [get_bd_cells s_ip_axi_ctrl_mgmt_01]
create_bd_cell -type ip -vlnv xilinx.com:ip:axi_register_slice:2.1 m_ip_axi_ctrl_mgmt_01
set_property -dict [list \
  CONFIG.ADDR_WIDTH 24 \
  CONFIG.DATA_WIDTH 32 \
  CONFIG.NUM_READ_OUTSTANDING 2 \
  CONFIG.NUM_WRITE_OUTSTANDING 2 \
  CONFIG.PROTOCOL AXI4LITE \
  CONFIG.READ_WRITE_MODE READ_WRITE \
  CONFIG.REG_AR 0 \
  CONFIG.REG_AW 0 \
  CONFIG.REG_B 0 \
  CONFIG.REG_R 0 \
  CONFIG.REG_W 0 \
] [get_bd_cells m_ip_axi_ctrl_mgmt_01]
create_bd_cell -type ip -vlnv xilinx.com:ip:axi_register_slice:2.1 s_ip_axi_ctrl_user_00
set_property -dict [list \
  CONFIG.ADDR_WIDTH 25 \
  CONFIG.DATA_WIDTH 32 \
  CONFIG.NUM_READ_OUTSTANDING 2 \
  CONFIG.NUM_WRITE_OUTSTANDING 2 \
  CONFIG.PROTOCOL AXI4LITE \
  CONFIG.READ_WRITE_MODE READ_WRITE \
  CONFIG.REG_AR 0 \
  CONFIG.REG_AW 0 \
  CONFIG.REG_B 0 \
  CONFIG.REG_R 0 \
  CONFIG.REG_W 0 \
] [get_bd_cells s_ip_axi_ctrl_user_00]
create_bd_cell -type ip -vlnv xilinx.com:ip:axi_register_slice:2.1 m_ip_axi_ctrl_user_00
set_property -dict [list \
  CONFIG.ADDR_WIDTH 25 \
  CONFIG.DATA_WIDTH 32 \
  CONFIG.NUM_READ_OUTSTANDING 2 \
  CONFIG.NUM_WRITE_OUTSTANDING 2 \
  CONFIG.PROTOCOL AXI4LITE \
  CONFIG.READ_WRITE_MODE READ_WRITE \
  CONFIG.REG_AR 0 \
  CONFIG.REG_AW 0 \
  CONFIG.REG_B 0 \
  CONFIG.REG_R 0 \
  CONFIG.REG_W 0 \
] [get_bd_cells m_ip_axi_ctrl_user_00]
create_bd_cell -type ip -vlnv xilinx.com:ip:axi_register_slice:2.1 s_ip_axi_ctrl_user_01
set_property -dict [list \
  CONFIG.ADDR_WIDTH 25 \
  CONFIG.DATA_WIDTH 32 \
  CONFIG.NUM_READ_OUTSTANDING 2 \
  CONFIG.NUM_WRITE_OUTSTANDING 2 \
  CONFIG.PROTOCOL AXI4LITE \
  CONFIG.READ_WRITE_MODE READ_WRITE \
  CONFIG.REG_AR 0 \
  CONFIG.REG_AW 0 \
  CONFIG.REG_B 0 \
  CONFIG.REG_R 0 \
  CONFIG.REG_W 0 \
] [get_bd_cells s_ip_axi_ctrl_user_01]
create_bd_cell -type ip -vlnv xilinx.com:ip:axi_register_slice:2.1 m_ip_axi_ctrl_user_01
set_property -dict [list \
  CONFIG.ADDR_WIDTH 25 \
  CONFIG.DATA_WIDTH 32 \
  CONFIG.NUM_READ_OUTSTANDING 2 \
  CONFIG.NUM_WRITE_OUTSTANDING 2 \
  CONFIG.PROTOCOL AXI4LITE \
  CONFIG.READ_WRITE_MODE READ_WRITE \
  CONFIG.REG_AR 0 \
  CONFIG.REG_AW 0 \
  CONFIG.REG_B 0 \
  CONFIG.REG_R 0 \
  CONFIG.REG_W 0 \
] [get_bd_cells m_ip_axi_ctrl_user_01]
create_bd_cell -type ip -vlnv xilinx.com:ip:axi_register_slice:2.1 s_ip_axi_ctrl_user_02
set_property -dict [list \
  CONFIG.ADDR_WIDTH 25 \
  CONFIG.DATA_WIDTH 32 \
  CONFIG.NUM_READ_OUTSTANDING 2 \
  CONFIG.NUM_WRITE_OUTSTANDING 2 \
  CONFIG.PROTOCOL AXI4LITE \
  CONFIG.READ_WRITE_MODE READ_WRITE \
  CONFIG.REG_AR 0 \
  CONFIG.REG_AW 0 \
  CONFIG.REG_B 0 \
  CONFIG.REG_R 0 \
  CONFIG.REG_W 0 \
] [get_bd_cells s_ip_axi_ctrl_user_02]
create_bd_cell -type ip -vlnv xilinx.com:ip:axi_register_slice:2.1 m_ip_axi_ctrl_user_02
set_property -dict [list \
  CONFIG.ADDR_WIDTH 25 \
  CONFIG.DATA_WIDTH 32 \
  CONFIG.NUM_READ_OUTSTANDING 2 \
  CONFIG.NUM_WRITE_OUTSTANDING 2 \
  CONFIG.PROTOCOL AXI4LITE \
  CONFIG.READ_WRITE_MODE READ_WRITE \
  CONFIG.REG_AR 0 \
  CONFIG.REG_AW 0 \
  CONFIG.REG_B 0 \
  CONFIG.REG_R 0 \
  CONFIG.REG_W 0 \
] [get_bd_cells m_ip_axi_ctrl_user_02]
create_bd_cell -type ip -vlnv xilinx.com:ip:axi_register_slice:2.1 s_ip_axi_ctrl_user_03
set_property -dict [list \
  CONFIG.ADDR_WIDTH 25 \
  CONFIG.DATA_WIDTH 32 \
  CONFIG.NUM_READ_OUTSTANDING 2 \
  CONFIG.NUM_WRITE_OUTSTANDING 2 \
  CONFIG.PROTOCOL AXI4LITE \
  CONFIG.READ_WRITE_MODE READ_WRITE \
  CONFIG.REG_AR 0 \
  CONFIG.REG_AW 0 \
  CONFIG.REG_B 0 \
  CONFIG.REG_R 0 \
  CONFIG.REG_W 0 \
] [get_bd_cells s_ip_axi_ctrl_user_03]
create_bd_cell -type ip -vlnv xilinx.com:ip:axi_register_slice:2.1 m_ip_axi_ctrl_user_03
set_property -dict [list \
  CONFIG.ADDR_WIDTH 25 \
  CONFIG.DATA_WIDTH 32 \
  CONFIG.NUM_READ_OUTSTANDING 2 \
  CONFIG.NUM_WRITE_OUTSTANDING 2 \
  CONFIG.PROTOCOL AXI4LITE \
  CONFIG.READ_WRITE_MODE READ_WRITE \
  CONFIG.REG_AR 0 \
  CONFIG.REG_AW 0 \
  CONFIG.REG_B 0 \
  CONFIG.REG_R 0 \
  CONFIG.REG_W 0 \
] [get_bd_cells m_ip_axi_ctrl_user_03]
create_bd_cell -type ip -vlnv xilinx.com:ip:axi_register_slice:2.1 s_ip_axi_ctrl_user_debug_00
set_property -dict [list \
  CONFIG.ADDR_WIDTH 25 \
  CONFIG.DATA_WIDTH 32 \
  CONFIG.HAS_BRESP 1 \
  CONFIG.HAS_BURST 0 \
  CONFIG.HAS_CACHE 0 \
  CONFIG.HAS_LOCK 0 \
  CONFIG.HAS_PROT 1 \
  CONFIG.HAS_QOS 0 \
  CONFIG.HAS_REGION 1 \
  CONFIG.HAS_RRESP 1 \
  CONFIG.HAS_WSTRB 1 \
  CONFIG.MAX_BURST_LENGTH 1 \
  CONFIG.NUM_READ_OUTSTANDING 2 \
  CONFIG.NUM_READ_THREADS 1 \
  CONFIG.NUM_WRITE_OUTSTANDING 2 \
  CONFIG.NUM_WRITE_THREADS 1 \
  CONFIG.PROTOCOL AXI4LITE \
  CONFIG.READ_WRITE_MODE READ_WRITE \
  CONFIG.REG_AR 0 \
  CONFIG.REG_AW 0 \
  CONFIG.REG_B 0 \
  CONFIG.REG_R 0 \
  CONFIG.REG_W 0 \
  CONFIG.RUSER_BITS_PER_BYTE 0 \
  CONFIG.SUPPORTS_NARROW_BURST 0 \
  CONFIG.WUSER_BITS_PER_BYTE 0 \
] [get_bd_cells s_ip_axi_ctrl_user_debug_00]
create_bd_cell -type ip -vlnv xilinx.com:ip:axi_register_slice:2.1 m_ip_axi_ctrl_user_debug_00
set_property -dict [list \
  CONFIG.ADDR_WIDTH 25 \
  CONFIG.DATA_WIDTH 32 \
  CONFIG.HAS_BRESP 1 \
  CONFIG.HAS_BURST 0 \
  CONFIG.HAS_CACHE 0 \
  CONFIG.HAS_LOCK 0 \
  CONFIG.HAS_PROT 1 \
  CONFIG.HAS_QOS 0 \
  CONFIG.HAS_REGION 1 \
  CONFIG.HAS_RRESP 1 \
  CONFIG.HAS_WSTRB 1 \
  CONFIG.MAX_BURST_LENGTH 1 \
  CONFIG.NUM_READ_OUTSTANDING 2 \
  CONFIG.NUM_READ_THREADS 1 \
  CONFIG.NUM_WRITE_OUTSTANDING 2 \
  CONFIG.NUM_WRITE_THREADS 1 \
  CONFIG.PROTOCOL AXI4LITE \
  CONFIG.READ_WRITE_MODE READ_WRITE \
  CONFIG.REG_AR 0 \
  CONFIG.REG_AW 0 \
  CONFIG.REG_B 0 \
  CONFIG.REG_R 0 \
  CONFIG.REG_W 0 \
  CONFIG.RUSER_BITS_PER_BYTE 0 \
  CONFIG.SUPPORTS_NARROW_BURST 0 \
  CONFIG.WUSER_BITS_PER_BYTE 0 \
] [get_bd_cells m_ip_axi_ctrl_user_debug_00]
create_bd_cell -type ip -vlnv xilinx.com:ip:axi_register_slice:2.1 s_ip_axi_data_c2h_00
set_property -dict [list \
  CONFIG.ADDR_WIDTH 39 \
  CONFIG.ARUSER_WIDTH 0 \
  CONFIG.AWUSER_WIDTH 0 \
  CONFIG.BUSER_WIDTH 0 \
  CONFIG.DATA_WIDTH 512 \
  CONFIG.HAS_BRESP 1 \
  CONFIG.HAS_BURST 1 \
  CONFIG.HAS_CACHE 1 \
  CONFIG.HAS_LOCK 1 \
  CONFIG.HAS_PROT 1 \
  CONFIG.HAS_QOS 0 \
  CONFIG.HAS_REGION 0 \
  CONFIG.HAS_RRESP 1 \
  CONFIG.HAS_WSTRB 1 \
  CONFIG.ID_WIDTH 4 \
  CONFIG.MAX_BURST_LENGTH 256 \
  CONFIG.NUM_READ_OUTSTANDING 64 \
  CONFIG.NUM_READ_THREADS 2 \
  CONFIG.NUM_WRITE_OUTSTANDING 32 \
  CONFIG.NUM_WRITE_THREADS 2 \
  CONFIG.PROTOCOL AXI4 \
  CONFIG.READ_WRITE_MODE READ_WRITE \
  CONFIG.REG_AR 0 \
  CONFIG.REG_AW 0 \
  CONFIG.REG_B 0 \
  CONFIG.REG_R 0 \
  CONFIG.REG_W 0 \
  CONFIG.RUSER_BITS_PER_BYTE 0 \
  CONFIG.RUSER_WIDTH 0 \
  CONFIG.SUPPORTS_NARROW_BURST 0 \
  CONFIG.WUSER_BITS_PER_BYTE 0 \
  CONFIG.WUSER_WIDTH 0 \
] [get_bd_cells s_ip_axi_data_c2h_00]
create_bd_cell -type ip -vlnv xilinx.com:ip:axi_register_slice:2.1 m_ip_axi_data_c2h_00
set_property -dict [list \
  CONFIG.ADDR_WIDTH 39 \
  CONFIG.ARUSER_WIDTH 0 \
  CONFIG.AWUSER_WIDTH 0 \
  CONFIG.BUSER_WIDTH 0 \
  CONFIG.DATA_WIDTH 512 \
  CONFIG.HAS_BRESP 1 \
  CONFIG.HAS_BURST 1 \
  CONFIG.HAS_CACHE 1 \
  CONFIG.HAS_LOCK 1 \
  CONFIG.HAS_PROT 1 \
  CONFIG.HAS_QOS 0 \
  CONFIG.HAS_REGION 0 \
  CONFIG.HAS_RRESP 1 \
  CONFIG.HAS_WSTRB 1 \
  CONFIG.ID_WIDTH 4 \
  CONFIG.MAX_BURST_LENGTH 256 \
  CONFIG.NUM_READ_OUTSTANDING 64 \
  CONFIG.NUM_READ_THREADS 2 \
  CONFIG.NUM_WRITE_OUTSTANDING 32 \
  CONFIG.NUM_WRITE_THREADS 2 \
  CONFIG.PROTOCOL AXI4 \
  CONFIG.READ_WRITE_MODE READ_WRITE \
  CONFIG.REG_AR 0 \
  CONFIG.REG_AW 0 \
  CONFIG.REG_B 0 \
  CONFIG.REG_R 0 \
  CONFIG.REG_W 0 \
  CONFIG.RUSER_BITS_PER_BYTE 0 \
  CONFIG.RUSER_WIDTH 0 \
  CONFIG.SUPPORTS_NARROW_BURST 0 \
  CONFIG.WUSER_BITS_PER_BYTE 0 \
  CONFIG.WUSER_WIDTH 0 \
] [get_bd_cells m_ip_axi_data_c2h_00]
create_bd_cell -type ip -vlnv xilinx.com:ip:axi_register_slice:2.1 s_ip_axi_data_h2c_00
set_property -dict [list \
  CONFIG.ADDR_WIDTH 39 \
  CONFIG.ARUSER_WIDTH 0 \
  CONFIG.AWUSER_WIDTH 0 \
  CONFIG.BUSER_WIDTH 0 \
  CONFIG.DATA_WIDTH 512 \
  CONFIG.HAS_BRESP 1 \
  CONFIG.HAS_BURST 1 \
  CONFIG.HAS_CACHE 1 \
  CONFIG.HAS_LOCK 1 \
  CONFIG.HAS_PROT 1 \
  CONFIG.HAS_QOS 0 \
  CONFIG.HAS_REGION 0 \
  CONFIG.HAS_RRESP 1 \
  CONFIG.HAS_WSTRB 1 \
  CONFIG.ID_WIDTH 4 \
  CONFIG.MAX_BURST_LENGTH 256 \
  CONFIG.NUM_READ_OUTSTANDING 16 \
  CONFIG.NUM_READ_THREADS 2 \
  CONFIG.NUM_WRITE_OUTSTANDING 32 \
  CONFIG.NUM_WRITE_THREADS 2 \
  CONFIG.PROTOCOL AXI4 \
  CONFIG.READ_WRITE_MODE READ_WRITE \
  CONFIG.REG_AR 0 \
  CONFIG.REG_AW 0 \
  CONFIG.REG_B 0 \
  CONFIG.REG_R 0 \
  CONFIG.REG_W 0 \
  CONFIG.RUSER_BITS_PER_BYTE 0 \
  CONFIG.RUSER_WIDTH 0 \
  CONFIG.SUPPORTS_NARROW_BURST 0 \
  CONFIG.WUSER_BITS_PER_BYTE 0 \
  CONFIG.WUSER_WIDTH 0 \
] [get_bd_cells s_ip_axi_data_h2c_00]
create_bd_cell -type ip -vlnv xilinx.com:ip:axi_register_slice:2.1 m_ip_axi_data_h2c_00
set_property -dict [list \
  CONFIG.ADDR_WIDTH 39 \
  CONFIG.ARUSER_WIDTH 0 \
  CONFIG.AWUSER_WIDTH 0 \
  CONFIG.BUSER_WIDTH 0 \
  CONFIG.DATA_WIDTH 512 \
  CONFIG.HAS_BRESP 1 \
  CONFIG.HAS_BURST 1 \
  CONFIG.HAS_CACHE 1 \
  CONFIG.HAS_LOCK 1 \
  CONFIG.HAS_PROT 1 \
  CONFIG.HAS_QOS 0 \
  CONFIG.HAS_REGION 0 \
  CONFIG.HAS_RRESP 1 \
  CONFIG.HAS_WSTRB 1 \
  CONFIG.ID_WIDTH 4 \
  CONFIG.MAX_BURST_LENGTH 256 \
  CONFIG.NUM_READ_OUTSTANDING 16 \
  CONFIG.NUM_READ_THREADS 2 \
  CONFIG.NUM_WRITE_OUTSTANDING 32 \
  CONFIG.NUM_WRITE_THREADS 2 \
  CONFIG.PROTOCOL AXI4 \
  CONFIG.READ_WRITE_MODE READ_WRITE \
  CONFIG.REG_AR 0 \
  CONFIG.REG_AW 0 \
  CONFIG.REG_B 0 \
  CONFIG.REG_R 0 \
  CONFIG.REG_W 0 \
  CONFIG.RUSER_BITS_PER_BYTE 0 \
  CONFIG.RUSER_WIDTH 0 \
  CONFIG.SUPPORTS_NARROW_BURST 0 \
  CONFIG.WUSER_BITS_PER_BYTE 0 \
  CONFIG.WUSER_WIDTH 0 \
] [get_bd_cells m_ip_axi_data_h2c_00]
create_bd_cell -type ip -vlnv xilinx.com:ip:axi_register_slice:2.1 s_ip_axi_data_h2c_01
set_property -dict [list \
  CONFIG.ADDR_WIDTH 39 \
  CONFIG.ARUSER_WIDTH 0 \
  CONFIG.AWUSER_WIDTH 0 \
  CONFIG.BUSER_WIDTH 0 \
  CONFIG.DATA_WIDTH 512 \
  CONFIG.HAS_BRESP 1 \
  CONFIG.HAS_BURST 1 \
  CONFIG.HAS_CACHE 1 \
  CONFIG.HAS_LOCK 1 \
  CONFIG.HAS_PROT 1 \
  CONFIG.HAS_QOS 0 \
  CONFIG.HAS_REGION 0 \
  CONFIG.HAS_RRESP 1 \
  CONFIG.HAS_WSTRB 1 \
  CONFIG.ID_WIDTH 4 \
  CONFIG.MAX_BURST_LENGTH 256 \
  CONFIG.NUM_READ_OUTSTANDING 16 \
  CONFIG.NUM_READ_THREADS 2 \
  CONFIG.NUM_WRITE_OUTSTANDING 32 \
  CONFIG.NUM_WRITE_THREADS 2 \
  CONFIG.PROTOCOL AXI4 \
  CONFIG.READ_WRITE_MODE READ_WRITE \
  CONFIG.REG_AR 0 \
  CONFIG.REG_AW 0 \
  CONFIG.REG_B 0 \
  CONFIG.REG_R 0 \
  CONFIG.REG_W 0 \
  CONFIG.RUSER_BITS_PER_BYTE 0 \
  CONFIG.RUSER_WIDTH 0 \
  CONFIG.SUPPORTS_NARROW_BURST 0 \
  CONFIG.WUSER_BITS_PER_BYTE 0 \
  CONFIG.WUSER_WIDTH 0 \
] [get_bd_cells s_ip_axi_data_h2c_01]
create_bd_cell -type ip -vlnv xilinx.com:ip:axi_register_slice:2.1 m_ip_axi_data_h2c_01
set_property -dict [list \
  CONFIG.ADDR_WIDTH 39 \
  CONFIG.ARUSER_WIDTH 0 \
  CONFIG.AWUSER_WIDTH 0 \
  CONFIG.BUSER_WIDTH 0 \
  CONFIG.DATA_WIDTH 512 \
  CONFIG.HAS_BRESP 1 \
  CONFIG.HAS_BURST 1 \
  CONFIG.HAS_CACHE 1 \
  CONFIG.HAS_LOCK 1 \
  CONFIG.HAS_PROT 1 \
  CONFIG.HAS_QOS 0 \
  CONFIG.HAS_REGION 0 \
  CONFIG.HAS_RRESP 1 \
  CONFIG.HAS_WSTRB 1 \
  CONFIG.ID_WIDTH 4 \
  CONFIG.MAX_BURST_LENGTH 256 \
  CONFIG.NUM_READ_OUTSTANDING 16 \
  CONFIG.NUM_READ_THREADS 2 \
  CONFIG.NUM_WRITE_OUTSTANDING 32 \
  CONFIG.NUM_WRITE_THREADS 2 \
  CONFIG.PROTOCOL AXI4 \
  CONFIG.READ_WRITE_MODE READ_WRITE \
  CONFIG.REG_AR 0 \
  CONFIG.REG_AW 0 \
  CONFIG.REG_B 0 \
  CONFIG.REG_R 0 \
  CONFIG.REG_W 0 \
  CONFIG.RUSER_BITS_PER_BYTE 0 \
  CONFIG.RUSER_WIDTH 0 \
  CONFIG.SUPPORTS_NARROW_BURST 0 \
  CONFIG.WUSER_BITS_PER_BYTE 0 \
  CONFIG.WUSER_WIDTH 0 \
] [get_bd_cells m_ip_axi_data_h2c_01]
create_bd_cell -type ip -vlnv xilinx.com:ip:axi_register_slice:2.1 s_ip_axi_data_h2c_02
set_property -dict [list \
  CONFIG.ADDR_WIDTH 39 \
  CONFIG.ARUSER_WIDTH 0 \
  CONFIG.AWUSER_WIDTH 0 \
  CONFIG.BUSER_WIDTH 0 \
  CONFIG.DATA_WIDTH 512 \
  CONFIG.HAS_BRESP 1 \
  CONFIG.HAS_BURST 1 \
  CONFIG.HAS_CACHE 1 \
  CONFIG.HAS_LOCK 1 \
  CONFIG.HAS_PROT 1 \
  CONFIG.HAS_QOS 0 \
  CONFIG.HAS_REGION 0 \
  CONFIG.HAS_RRESP 1 \
  CONFIG.HAS_WSTRB 1 \
  CONFIG.ID_WIDTH 4 \
  CONFIG.MAX_BURST_LENGTH 256 \
  CONFIG.NUM_READ_OUTSTANDING 16 \
  CONFIG.NUM_READ_THREADS 2 \
  CONFIG.NUM_WRITE_OUTSTANDING 32 \
  CONFIG.NUM_WRITE_THREADS 2 \
  CONFIG.PROTOCOL AXI4 \
  CONFIG.READ_WRITE_MODE READ_WRITE \
  CONFIG.REG_AR 0 \
  CONFIG.REG_AW 0 \
  CONFIG.REG_B 0 \
  CONFIG.REG_R 0 \
  CONFIG.REG_W 0 \
  CONFIG.RUSER_BITS_PER_BYTE 0 \
  CONFIG.RUSER_WIDTH 0 \
  CONFIG.SUPPORTS_NARROW_BURST 0 \
  CONFIG.WUSER_BITS_PER_BYTE 0 \
  CONFIG.WUSER_WIDTH 0 \
] [get_bd_cells s_ip_axi_data_h2c_02]
create_bd_cell -type ip -vlnv xilinx.com:ip:axi_register_slice:2.1 m_ip_axi_data_h2c_02
set_property -dict [list \
  CONFIG.ADDR_WIDTH 39 \
  CONFIG.ARUSER_WIDTH 0 \
  CONFIG.AWUSER_WIDTH 0 \
  CONFIG.BUSER_WIDTH 0 \
  CONFIG.DATA_WIDTH 512 \
  CONFIG.HAS_BRESP 1 \
  CONFIG.HAS_BURST 1 \
  CONFIG.HAS_CACHE 1 \
  CONFIG.HAS_LOCK 1 \
  CONFIG.HAS_PROT 1 \
  CONFIG.HAS_QOS 0 \
  CONFIG.HAS_REGION 0 \
  CONFIG.HAS_RRESP 1 \
  CONFIG.HAS_WSTRB 1 \
  CONFIG.ID_WIDTH 4 \
  CONFIG.MAX_BURST_LENGTH 256 \
  CONFIG.NUM_READ_OUTSTANDING 16 \
  CONFIG.NUM_READ_THREADS 2 \
  CONFIG.NUM_WRITE_OUTSTANDING 32 \
  CONFIG.NUM_WRITE_THREADS 2 \
  CONFIG.PROTOCOL AXI4 \
  CONFIG.READ_WRITE_MODE READ_WRITE \
  CONFIG.REG_AR 0 \
  CONFIG.REG_AW 0 \
  CONFIG.REG_B 0 \
  CONFIG.REG_R 0 \
  CONFIG.REG_W 0 \
  CONFIG.RUSER_BITS_PER_BYTE 0 \
  CONFIG.RUSER_WIDTH 0 \
  CONFIG.SUPPORTS_NARROW_BURST 0 \
  CONFIG.WUSER_BITS_PER_BYTE 0 \
  CONFIG.WUSER_WIDTH 0 \
] [get_bd_cells m_ip_axi_data_h2c_02]
create_bd_cell -type ip -vlnv xilinx.com:ip:axi_register_slice:2.1 s_ip_axi_data_h2c_03
set_property -dict [list \
  CONFIG.ADDR_WIDTH 39 \
  CONFIG.ARUSER_WIDTH 0 \
  CONFIG.AWUSER_WIDTH 0 \
  CONFIG.BUSER_WIDTH 0 \
  CONFIG.DATA_WIDTH 512 \
  CONFIG.HAS_BRESP 1 \
  CONFIG.HAS_BURST 1 \
  CONFIG.HAS_CACHE 1 \
  CONFIG.HAS_LOCK 1 \
  CONFIG.HAS_PROT 1 \
  CONFIG.HAS_QOS 0 \
  CONFIG.HAS_REGION 0 \
  CONFIG.HAS_RRESP 1 \
  CONFIG.HAS_WSTRB 1 \
  CONFIG.ID_WIDTH 4 \
  CONFIG.MAX_BURST_LENGTH 256 \
  CONFIG.NUM_READ_OUTSTANDING 16 \
  CONFIG.NUM_READ_THREADS 2 \
  CONFIG.NUM_WRITE_OUTSTANDING 32 \
  CONFIG.NUM_WRITE_THREADS 2 \
  CONFIG.PROTOCOL AXI4 \
  CONFIG.READ_WRITE_MODE READ_WRITE \
  CONFIG.REG_AR 0 \
  CONFIG.REG_AW 0 \
  CONFIG.REG_B 0 \
  CONFIG.REG_R 0 \
  CONFIG.REG_W 0 \
  CONFIG.RUSER_BITS_PER_BYTE 0 \
  CONFIG.RUSER_WIDTH 0 \
  CONFIG.SUPPORTS_NARROW_BURST 0 \
  CONFIG.WUSER_BITS_PER_BYTE 0 \
  CONFIG.WUSER_WIDTH 0 \
] [get_bd_cells s_ip_axi_data_h2c_03]
create_bd_cell -type ip -vlnv xilinx.com:ip:axi_register_slice:2.1 m_ip_axi_data_h2c_03
set_property -dict [list \
  CONFIG.ADDR_WIDTH 39 \
  CONFIG.ARUSER_WIDTH 0 \
  CONFIG.AWUSER_WIDTH 0 \
  CONFIG.BUSER_WIDTH 0 \
  CONFIG.DATA_WIDTH 512 \
  CONFIG.HAS_BRESP 1 \
  CONFIG.HAS_BURST 1 \
  CONFIG.HAS_CACHE 1 \
  CONFIG.HAS_LOCK 1 \
  CONFIG.HAS_PROT 1 \
  CONFIG.HAS_QOS 0 \
  CONFIG.HAS_REGION 0 \
  CONFIG.HAS_RRESP 1 \
  CONFIG.HAS_WSTRB 1 \
  CONFIG.ID_WIDTH 4 \
  CONFIG.MAX_BURST_LENGTH 256 \
  CONFIG.NUM_READ_OUTSTANDING 16 \
  CONFIG.NUM_READ_THREADS 2 \
  CONFIG.NUM_WRITE_OUTSTANDING 32 \
  CONFIG.NUM_WRITE_THREADS 2 \
  CONFIG.PROTOCOL AXI4 \
  CONFIG.READ_WRITE_MODE READ_WRITE \
  CONFIG.REG_AR 0 \
  CONFIG.REG_AW 0 \
  CONFIG.REG_B 0 \
  CONFIG.REG_R 0 \
  CONFIG.REG_W 0 \
  CONFIG.RUSER_BITS_PER_BYTE 0 \
  CONFIG.RUSER_WIDTH 0 \
  CONFIG.SUPPORTS_NARROW_BURST 0 \
  CONFIG.WUSER_BITS_PER_BYTE 0 \
  CONFIG.WUSER_WIDTH 0 \
] [get_bd_cells m_ip_axi_data_h2c_03]
create_bd_cell -type ip -vlnv xilinx.com:ip:axi_register_slice:2.1 s_ip_axi_data_u2s_00
set_property -dict [list \
  CONFIG.ADDR_WIDTH 39 \
  CONFIG.ARUSER_WIDTH 0 \
  CONFIG.AWUSER_WIDTH 0 \
  CONFIG.BUSER_WIDTH 0 \
  CONFIG.DATA_WIDTH 512 \
  CONFIG.HAS_BRESP 1 \
  CONFIG.HAS_BURST 1 \
  CONFIG.HAS_CACHE 1 \
  CONFIG.HAS_LOCK 1 \
  CONFIG.HAS_PROT 1 \
  CONFIG.HAS_QOS 0 \
  CONFIG.HAS_REGION 0 \
  CONFIG.HAS_RRESP 1 \
  CONFIG.HAS_WSTRB 1 \
  CONFIG.ID_WIDTH 4 \
  CONFIG.MAX_BURST_LENGTH 256 \
  CONFIG.NUM_READ_OUTSTANDING 16 \
  CONFIG.NUM_READ_THREADS 2 \
  CONFIG.NUM_WRITE_OUTSTANDING 32 \
  CONFIG.NUM_WRITE_THREADS 2 \
  CONFIG.PROTOCOL AXI4 \
  CONFIG.READ_WRITE_MODE READ_WRITE \
  CONFIG.REG_AR 0 \
  CONFIG.REG_AW 0 \
  CONFIG.REG_B 0 \
  CONFIG.REG_R 0 \
  CONFIG.REG_W 0 \
  CONFIG.RUSER_BITS_PER_BYTE 0 \
  CONFIG.RUSER_WIDTH 0 \
  CONFIG.SUPPORTS_NARROW_BURST 0 \
  CONFIG.WUSER_BITS_PER_BYTE 0 \
  CONFIG.WUSER_WIDTH 0 \
] [get_bd_cells s_ip_axi_data_u2s_00]
create_bd_cell -type ip -vlnv xilinx.com:ip:axi_register_slice:2.1 m_ip_axi_data_u2s_00
set_property -dict [list \
  CONFIG.ADDR_WIDTH 39 \
  CONFIG.ARUSER_WIDTH 0 \
  CONFIG.AWUSER_WIDTH 0 \
  CONFIG.BUSER_WIDTH 0 \
  CONFIG.DATA_WIDTH 512 \
  CONFIG.HAS_BRESP 1 \
  CONFIG.HAS_BURST 1 \
  CONFIG.HAS_CACHE 1 \
  CONFIG.HAS_LOCK 1 \
  CONFIG.HAS_PROT 1 \
  CONFIG.HAS_QOS 0 \
  CONFIG.HAS_REGION 0 \
  CONFIG.HAS_RRESP 1 \
  CONFIG.HAS_WSTRB 1 \
  CONFIG.ID_WIDTH 4 \
  CONFIG.MAX_BURST_LENGTH 256 \
  CONFIG.NUM_READ_OUTSTANDING 16 \
  CONFIG.NUM_READ_THREADS 2 \
  CONFIG.NUM_WRITE_OUTSTANDING 32 \
  CONFIG.NUM_WRITE_THREADS 2 \
  CONFIG.PROTOCOL AXI4 \
  CONFIG.READ_WRITE_MODE READ_WRITE \
  CONFIG.REG_AR 0 \
  CONFIG.REG_AW 0 \
  CONFIG.REG_B 0 \
  CONFIG.REG_R 0 \
  CONFIG.REG_W 0 \
  CONFIG.RUSER_BITS_PER_BYTE 0 \
  CONFIG.RUSER_WIDTH 0 \
  CONFIG.SUPPORTS_NARROW_BURST 0 \
  CONFIG.WUSER_BITS_PER_BYTE 0 \
  CONFIG.WUSER_WIDTH 0 \
] [get_bd_cells m_ip_axi_data_u2s_00]
create_bd_cell -type ip -vlnv xilinx.com:ip:pipeline_reg:1.0 ip_data_ddr4_calib_complete_00
set_property -dict {CONFIG.DEPTH 0 CONFIG.WIDTH 1} [get_bd_cells ip_data_ddr4_calib_complete_00]
create_bd_cell -type ip -vlnv xilinx.com:ip:pipeline_reg:1.0 ip_data_satellite_ctrl_data_00
set_property -dict {CONFIG.DEPTH 0 CONFIG.WIDTH 4} [get_bd_cells ip_data_satellite_ctrl_data_00]
create_bd_cell -type ip -vlnv xilinx.com:ip:pipeline_reg:1.0 ip_irq_kernel_00
set_property -dict {CONFIG.DEPTH 0 CONFIG.WIDTH 128} [get_bd_cells ip_irq_kernel_00]
